# Altium schematic sheet ELEC3300_DAP.SchDoc
size A3
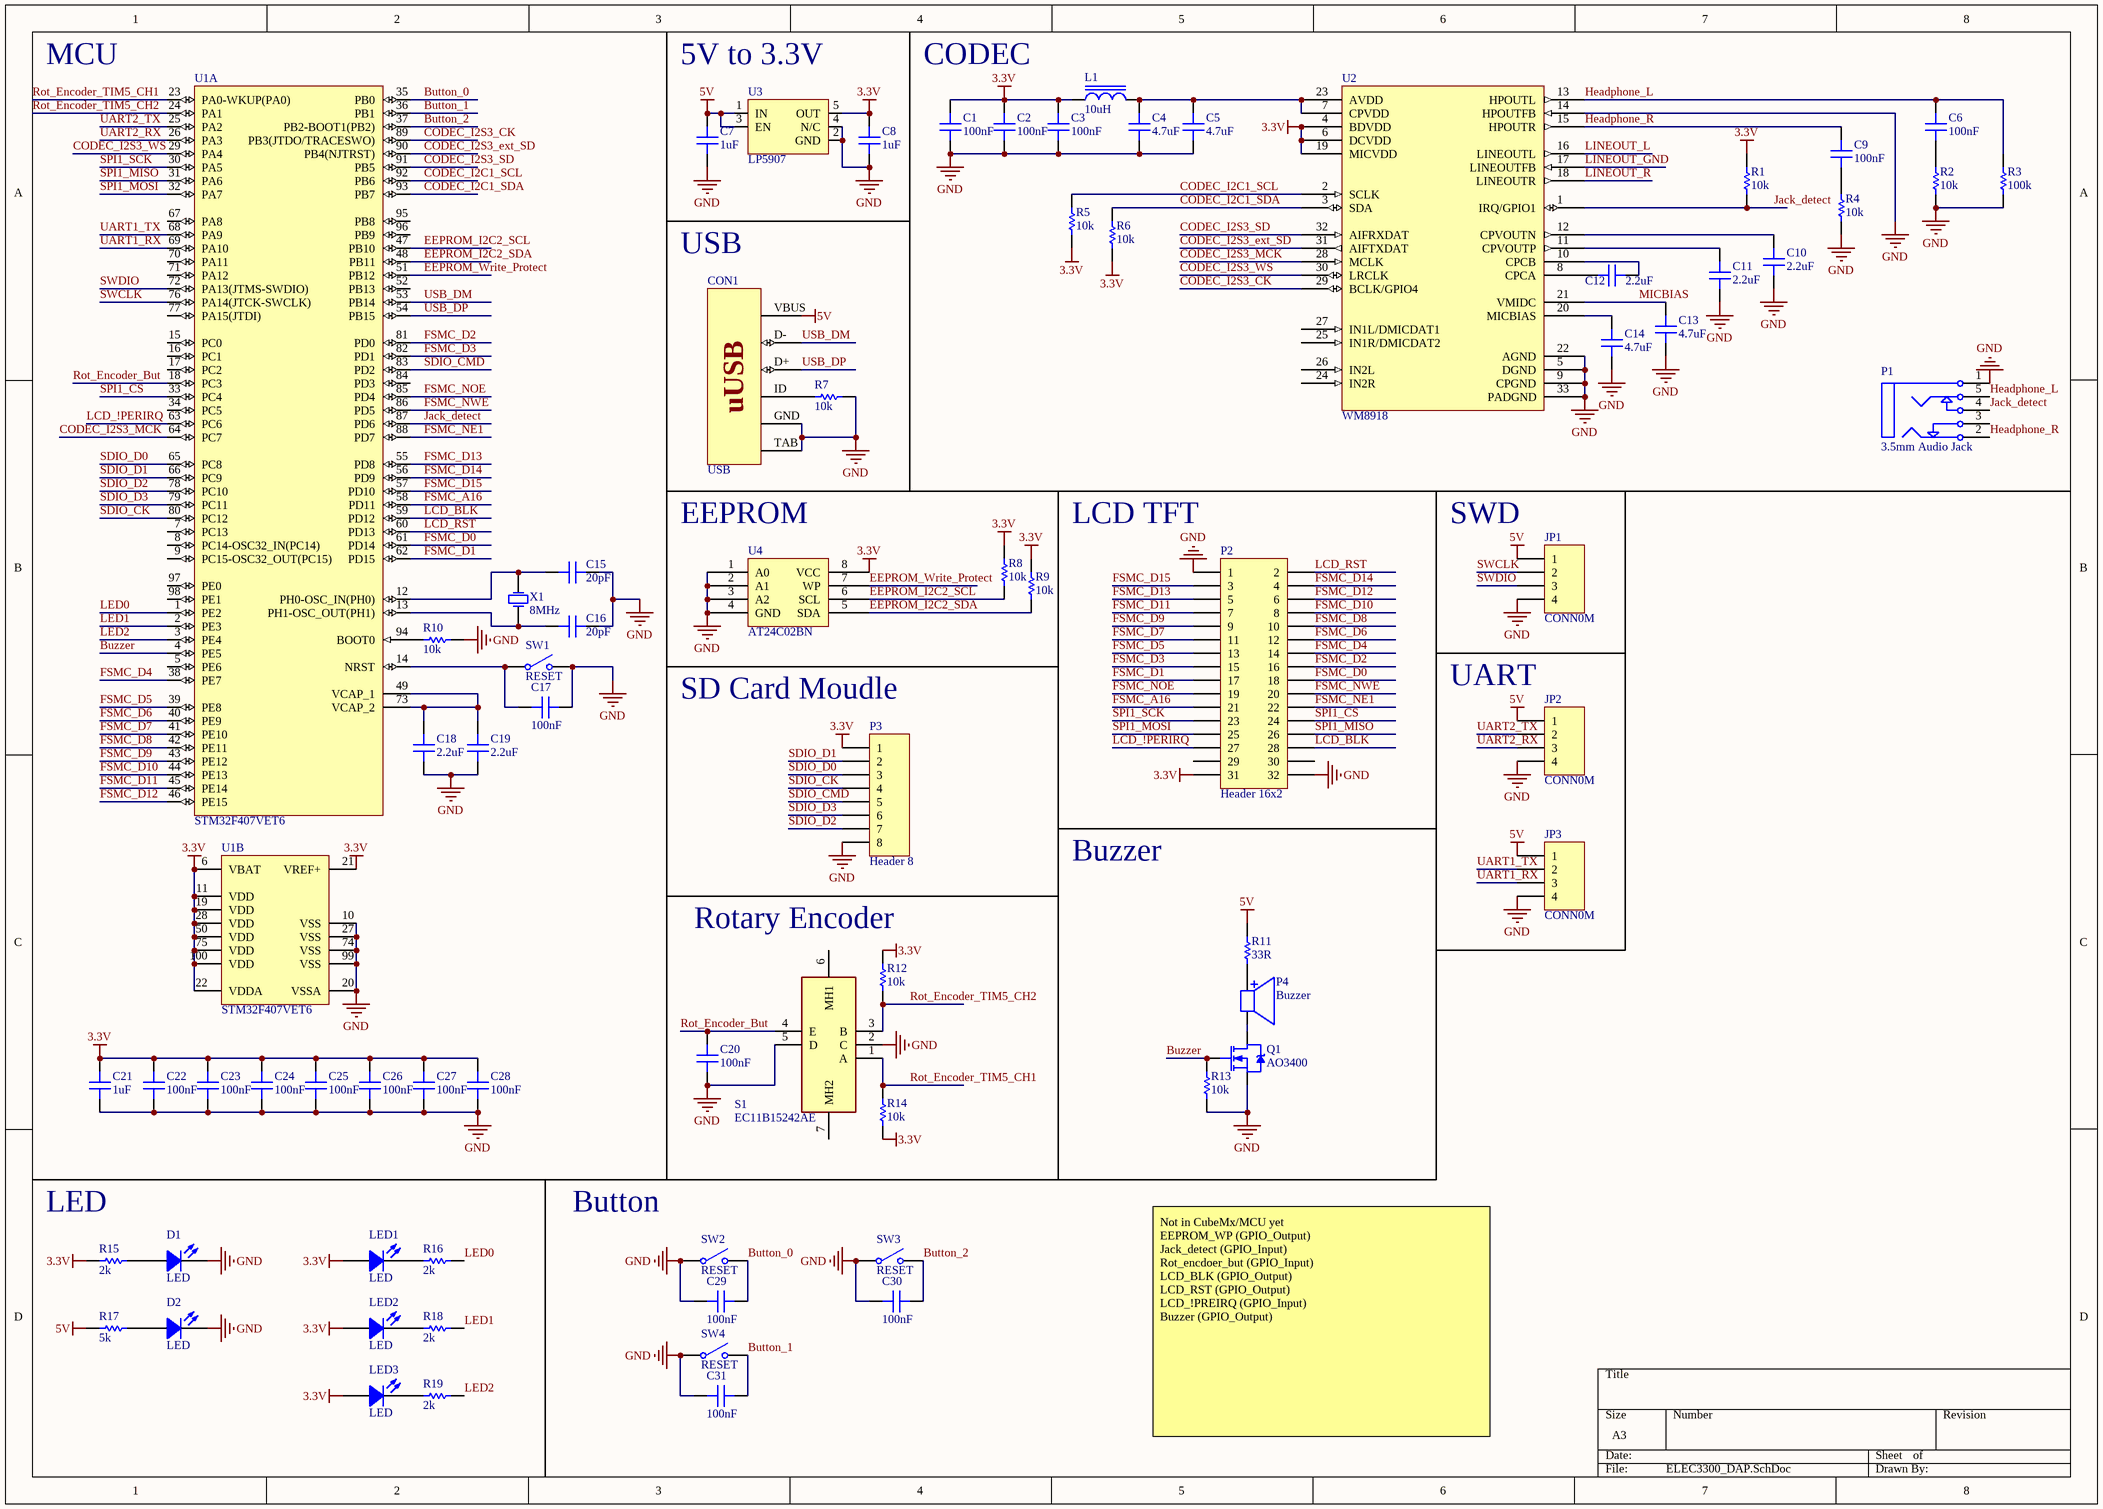
[diagram p0: ELEC3300_DAP.SchDoc]

## Parts
C1  100nF  [CC2012-0805]
C2  100nF  [CC2012-0805]
C3  100nF  [CC2012-0805]
C4  4.7uF  [CC2012-0805]
C5  4.7uF  [CC2012-0805]
C6  100nF  [CC2012-0805]
C7  1uF  [CC2012-0805]
C8  1uF  [CC2012-0805]
C9  100nF  [CC2012-0805]
C10  2.2uF  [CC2012-0805]
C11  2.2uF  [CC2012-0805]
C12  2.2uF  [CC2012-0805]
C13  4.7uF  [CC2012-0805]
C14  4.7uF  [CC2012-0805]
C15  20pF  [CC2012-0805]
C16  20pF  [CC2012-0805]
C17  100nF  [CC2012-0805]
C18  2.2uF  [CC2012-0805]
C19  2.2uF  [CC2012-0805]
C20  100nF  [CC2012-0805]
C21  1uF  [CC2012-0805]
C22  100nF  [CC2012-0805]
C23  100nF  [CC2012-0805]
C24  100nF  [CC2012-0805]
C25  100nF  [CC2012-0805]
C26  100nF  [CC2012-0805]
C27  100nF  [CC2012-0805]
C28  100nF  [CC2012-0805]
C29  100nF  [CC2012-0805]
C30  100nF  [CC2012-0805]
C31  100nF  [CC2012-0805]
CON1  USB  [USB-UB-S-HML]
D1  LED  [D0805]
D2  LED  [D0805]
JP1  CONN0M  [LOCKEDHDR-4W]
JP2  CONN0M  [LOCKEDHDR-4W]
JP3  CONN0M  [LOCKEDHDR-4W]
L1  10uH  [CL2012-0805]
LED1  LED  [D0805]
LED2  LED  [D0805]
LED3  LED  [D0805]
P1  3.5mm Audio Jack  [STX-3120-5B]
P2  Header 16x2  [HDR2X16]
P3  Header 8  [HDR1X8]
P4  Buzzer  [BUZ-9.0]
Q1  AO3400  [SO-G3/Z3.3]
R1  10k  [CR2012-0805]
R2  10k  [CR2012-0805]
R3  100k  [CR2012-0805]
R4  10k  [CR2012-0805]
R5  10k  [CR2012-0805]
R6  10k  [CR2012-0805]
R7  10k  [CR2012-0805]
R8  10k  [CR2012-0805]
R9  10k  [CR2012-0805]
R10  10k  [CR2012-0805]
R11  33R  [CR2012-0805]
R12  10k  [CR2012-0805]
R13  10k  [CR2012-0805]
R14  10k  [CR2012-0805]
R15  2k  [CR2012-0805]
R16  2k  [CR2012-0805]
R17  5k  [CR2012-0805]
R18  2k  [CR2012-0805]
R19  2k  [CR2012-0805]
S1  EC11B15242AE  [EC11B15242AE]
SW1  RESET  [PUSH SWITCH 2-PIN]
SW2  RESET  [PUSH SWITCH]
SW3  RESET  [PUSH SWITCH]
SW4  RESET  [PUSH SWITCH]
U1  STM32F407VET6  [STM-LQFP100_N]  (parts A,B of 2)
U2  WM8918  [QFN40P400X400X80-33N]
U3  LP5907  [SOT-23-5]
U4  AT24C02BN  [SOP-8]
X1  8MHz  [BCY-W2/E4.7]

## Nets
3.3V: C1.2 C2.2 C3.2 C8.2 C21.2 C22.2 C23.2 C24.2 C25.2 C26.2 C27.2 C28.2 L1.1 LED1.1(A) LED2.1(A) LED3.1(A) P2.31 P3.1 R1.1 R5.2 R6.2 R8.2 R9.2 R12.2 R14.1 R15.1 U1.6(VBAT) U1.11(VDD) U1.19(VDD) U1.21(VREF+) U1.22(VDDA) U1.28(VDD) U1.50(VDD) U1.75(VDD) U1.100(VDD) U2.4(BDVDD) U2.6(DCVDD) U2.19(MICVDD) U3.5(OUT) U4.8(VCC)
5V: C7.2 CON1.VBUS JP1.1 JP2.1 JP3.1 R11.2 R17.1 U3.1(IN) U3.3(EN)
GND: C1.1 C2.1 C3.1 C4.1 C5.1 C7.1 C8.1 C10.2 C11.1 C13.1 C14.1 C15.2 C16.2 C17.2 C18.1 C19.1 C20.2 C21.1 C22.1 C23.1 C24.1 C25.1 C26.1 C27.1 C28.1 C29.2 C30.2 C31.2 CON1.GND CON1.TAB D1.2(K) D2.2(K) JP1.4 JP2.4 JP3.4 P1.1 P2.1 P2.32 P3.8 Q1.2(S) R2.1 R3.1 R4.1 R7.2 R10.2 R13.1 S1.2(C) S1.5(D) SW1.2(NO) SW2.1(COMMON) SW3.1(COMMON) SW4.1(COMMON) U1.10(VSS) U1.20(VSSA) U1.27(VSS) U1.74(VSS) U1.99(VSS) U2.5(DGND) U2.9(CPGND) U2.14(HPOUTFB) U2.22(AGND) U2.33(PADGND) U3.2(GND) U3.4(N/C) U4.1(A0) U4.2(A1) U4.3(A2) U4.4(GND)
Button_0: C29.1 SW2.2(NO) U1.35(PB0)
Button_1: C31.1 SW4.2(NO) U1.36(PB1)
Button_2: C30.1 SW3.2(NO) U1.37(PB2-BOOT1(PB2))
Buzzer: Q1.1(G) R13.2 U1.4(PE5)
CODEC_I2C1_SCL: R5.1 U1.92(PB6) U2.2(SCLK)
CODEC_I2C1_SDA: R6.1 U1.93(PB7) U2.3(SDA)
CODEC_I2S3_CK: U1.89(PB3(JTDO/TRACESWO)) U2.29(BCLK/GPIO4)
CODEC_I2S3_ext_SD: U1.90(PB4(NJTRST)) U2.31(AIFTXDAT)
CODEC_I2S3_MCK: U1.64(PC7) U2.28(MCLK)
CODEC_I2S3_SD: U1.91(PB5) U2.32(AIFRXDAT)
CODEC_I2S3_WS: U1.29(PA4) U2.30(LRCLK)
EEPROM_I2C2_SCL: R8.1 U1.47(PB10) U4.6(SCL)
EEPROM_I2C2_SDA: R9.1 U1.48(PB11) U4.5(SDA)
EEPROM_Write_Protect: U1.51(PB12) U4.7(WP)
FSMC_A16: P2.21 U1.58(PD11)
FSMC_D0: P2.18 U1.61(PD14)
FSMC_D1: P2.17 U1.62(PD15)
FSMC_D2: P2.16 U1.81(PD0)
FSMC_D3: P2.15 U1.82(PD1)
FSMC_D4: P2.14 U1.38(PE7)
FSMC_D5: P2.13 U1.39(PE8)
FSMC_D6: P2.12 U1.40(PE9)
FSMC_D7: P2.11 U1.41(PE10)
FSMC_D8: P2.10 U1.42(PE11)
FSMC_D9: P2.9 U1.43(PE12)
FSMC_D10: P2.8 U1.44(PE13)
FSMC_D11: P2.7 U1.45(PE14)
FSMC_D12: P2.6 U1.46(PE15)
FSMC_D13: P2.5 U1.55(PD8)
FSMC_D14: P2.4 U1.56(PD9)
FSMC_D15: P2.3 U1.57(PD10)
FSMC_NE1: P2.22 U1.88(PD7)
FSMC_NOE: P2.19 U1.85(PD4)
FSMC_NWE: P2.20 U1.86(PD5)
Headphone_L: C6.2 P1.5 R3.2 U2.13(HPOUTL)
Headphone_R: C9.2 P1.2 U2.15(HPOUTR)
Jack_detect: P1.4 R1.2 U1.87(PD6) U2.1(IRQ/GPIO1)
LCD_!PERIRQ: P2.27 U1.63(PC6)
LCD_BLK: P2.28 U1.59(PD12)
LCD_RST: P2.2 U1.60(PD13)
LED0: R16.2 U1.1(PE2)
LED1: R18.2 U1.2(PE3)
LED2: R19.2 U1.3(PE4)
LINEOUT_GND: U2.17(LINEOUTFB)
LINEOUT_L: U2.16(LINEOUTL)
LINEOUT_R: U2.18(LINEOUTR)
MICBIAS: C13.2 U2.21(VMIDC)
Rot_Encoder_But: C20.1 S1.4(E) U1.18(PC3)
Rot_Encoder_TIM5_CH1: R14.2 S1.1(A) U1.23(PA0-WKUP(PA0))
Rot_Encoder_TIM5_CH2: R12.1 S1.3(B) U1.24(PA1)
SDIO_CK: P3.4 U1.80(PC12)
SDIO_CMD: P3.5 U1.83(PD2)
SDIO_D0: P3.3 U1.65(PC8)
SDIO_D1: P3.2 U1.66(PC9)
SDIO_D2: P3.7 U1.78(PC10)
SDIO_D3: P3.6 U1.79(PC11)
SPI1_CS: P2.24 U1.33(PC4)
SPI1_MISO: P2.26 U1.31(PA6)
SPI1_MOSI: P2.25 U1.32(PA7)
SPI1_SCK: P2.23 U1.30(PA5)
SWCLK: JP1.2 U1.76(PA14(JTCK-SWCLK))
SWDIO: JP1.3 U1.72(PA13(JTMS-SWDIO))
UART1_RX: JP3.3 U1.69(PA10)
UART1_TX: JP3.2 U1.68(PA9)
UART2_RX: JP2.3 U1.26(PA3)
UART2_TX: JP2.2 U1.25(PA2)
USB_DM: CON1.D- U1.53(PB14)
USB_DP: CON1.D+ U1.54(PB15)
NetC4_2: C4.2 C5.2 L1.2 U2.7(CPVDD) U2.23(AVDD)
NetC6_1: C6.1 R2.2
NetC9_1: C9.1 R4.2
NetC10_1: C10.1 U2.12(CPVOUTN)
NetC11_2: C11.2 U2.11(CPVOUTP)
NetC12_1: C12.1 U2.8(CPCA)
NetC12_2: C12.2 U2.10(CPCB)
NetC14_2: C14.2 U2.20(MICBIAS)
NetC15_1: C15.1 U1.12(PH0-OSC_IN(PH0)) X1.2(OSC2)
NetC16_1: C16.1 U1.13(PH1-OSC_OUT(PH1)) X1.1(OSC1)
NetC17_1: C17.1 SW1.1(COMMON) U1.14(NRST)
NetC18_2: C18.2 C19.2 U1.49(VCAP_1) U1.73(VCAP_2)
NetCON1_ID: CON1.ID R7.1
NetD1_1: D1.1(A) R15.2
NetD2_1: D2.1(A) R17.2
NetLED1_2: LED1.2(K) R16.1
NetLED2_2: LED2.2(K) R18.1
NetLED3_2: LED3.2(K) R19.1
NetP4_1: P4.1 R11.1
NetP4_2: P4.2 Q1.3(D)
NetR10_1: R10.1 U1.94(BOOT0)

Not connected (* = marked no-connect by the designer): P1 3; P2 29 30; S1 6(MH1) 7(MH2); U1 5(PE6) 7(PC13) 8(PC14-OSC32_IN(PC14)) 9(PC15-OSC32_OUT(PC15)) 15(PC0) 16(PC1) 17(PC2) 34(PC5) 52(PB13) 67(PA8) 70(PA11) 71(PA12) 77(PA15(JTDI)) 84(PD3) 95(PB8) 96(PB9) 97(PE0) 98(PE1); U2 24(IN2R) 25(IN1R/DMICDAT2) 26(IN2L) 27(IN1L/DMICDAT1)

## Notes on the sheet
- MCU
- 5V to 3.3V
- CODEC
- USB
- EEPROM
- LCD TFT
- SWD
- SD Card Moudle
- (near JP2) UART
- Buzzer
- Rotary Encoder
- (near R15) LED
- (near SW2) Button
- Not in CubeMx/MCU yet
  EEPROM_WP (GPIO_Output)
  Jack_detect (GPIO_Input)
  Rot_encdoer_but (GPIO_Input)
  LCD_BLK (GPIO_Output)
  LCD_RST (GPIO_Output)
  LCD_!PREIRQ (GPIO_Input)
  Buzzer (GPIO_Output)
- (in symbol USB Series Micro-B) uUSB

## Library data of the parts
C1-C31 = Cap Semi: Capacitor (Semiconductor SIM Model); Published: 8-Jun-2000; LatestRevisionDate: 17-Jul-2002; LatestRevisionNote: Re-released for DXP Platform.; PackageReference: C1206; Publisher: Altium Limited
CON1 = USB Series Micro-B
D1 D2 LED1-LED3 = LED: Typical RED GaAs LED; Published: 8-Jun-2000; LatestRevisionDate: 08-Jul-2005; LatestRevisionNote: Mech Layer 1 removed.; PackageReference: LED-1; Publisher: Altium Limited
JP1-JP3 = Header 4: Header, 4-Pin; Revision: 17-Jul-2002: Re-released for DXP Platform.; Publisher: Altium Limited
L1 = Inductor: Published: 8-Jun-2000; Revision: July-2002: Re-released for DXP Platform.; Publisher: Altium Limited; Value: 10uH
P1 = Audio Jack 3P: Conductor Jack with 2 break contacts (normals) and 2 auxiliary make contacts
P3 = Header 8: Header, 8-Pin; LatestRevisionDate: 17-Jul-2002; LatestRevisionNote: Re-released for DXP Platform.; Publisher: Altium Limited
Q1 = AO3400: N-Channel MOSFET; Published: 8-Jun-2000; Revision: July-2002: Re-released for DXP Platform.; Publisher: Altium Limited
R1-R19 = Res Semi: Semiconductor Resistor; Published: 8-Jun-2000; LatestRevisionDate: 17-Jul-2002; LatestRevisionNote: Re-released for DXP Platform.; Publisher: Altium Limited
S1 = EC11B15242AE: Switch; Manufacturer_Name: ALPS; Height: 13mm; Manufacturer_Part_Number: EC11B15242AE; Mouser Part Number: 688-EC11B15242AE; Mouser Price/Stock: http://www.mouser.com/Search/ProductDetail.aspx?qs=PoKhxlfUXjIm2pRMScFQOQ%3d%3d
SW1-SW4 = SW-SPST: Single-Pole, Single-Throw Switch; Published: 24-Mar-1999; Revision: July-2002: Re-released for DXP Platform.; Publisher: Altium Limited
U1 = STM32F407VET6: ARM Cortex-M4 32-bit MCU+FPU, 210 DMIPS, 512 kB Flash, 192 kB Internal RAM, 82 I/Os, 100-pin LQFP, -40 to 85 degC, Tray; Manufacturer: STMicroelectronics; D/A Converter: 2x12-bit; FLASH Size (Prog) (kB): 512; I/Os (High Current): 82; Internal RAM Size (kB): 192; Operating Frequency(F) (Processor speed) (MHz): 168; Supply Voltage(Vcc) max (V): 3.6; Supply Voltage(Vcc) min (V): 1.8; DatasheetVersion: Rev. 4; PackageVersion: Rev. 1, 06/2013; PackageReference: LQFP100; PackageDescription: 100-Pin Low Profile Quad Flat Package, 14 x 14 mm Body, 0.5 mm Pitch; Supplier 1: Digi-Key; Supplier Part Number 1: 497-12075-ND; Supplier 2: Farnell; Supplier Part Number 2: 2064367; Supplier 3: Newark; Supplier Part Number 3: 73T2332; Supplier 4: Mouser; Supplier Part Number 4: 511-STM32F407VET6; Core: ARM Cortex-M4; Packing: Tray; Mounting Technology: Surface Mount; PartNumber: STM32F407VET6; ComponentLink1Description: Manufacturer URL; ComponentLink1URL: http://www.st.com/web/en/home.html; ComponentLink2Description: Datasheet; ComponentLink2URL: http://www.st.com/st-web-ui/static/active/en/resource/technical/document/datasheet/DM00037051.pdf; ComponentLink3Description: Package Specification; ComponentLink3URL: http://www.st.com/st-web-ui/static/active/en/resource/technical/document/data_brief/DM00071938.pdf
U2 = WM8918: Ultra Low Power Stereo DAC with Headphone Driver, 3 Line Inputs, All standard sample rates from 8 kHz to 96 kH
U3 = LP5907: LDO / Input: 2.2V to 5.5V / Output: 3.3V 250mA / Enable: high volt-> turns on
U4 = AT24C02BN: Two-wire Serial EEPROM
X1 = XTAL: Crystal Oscillator; Published: 8-Jun-2000; Revision: July-2002: Re-released for DXP Platform.; Publisher: Altium Limited